# EAGLE design Line follwer (EAGLE 7.6.0)
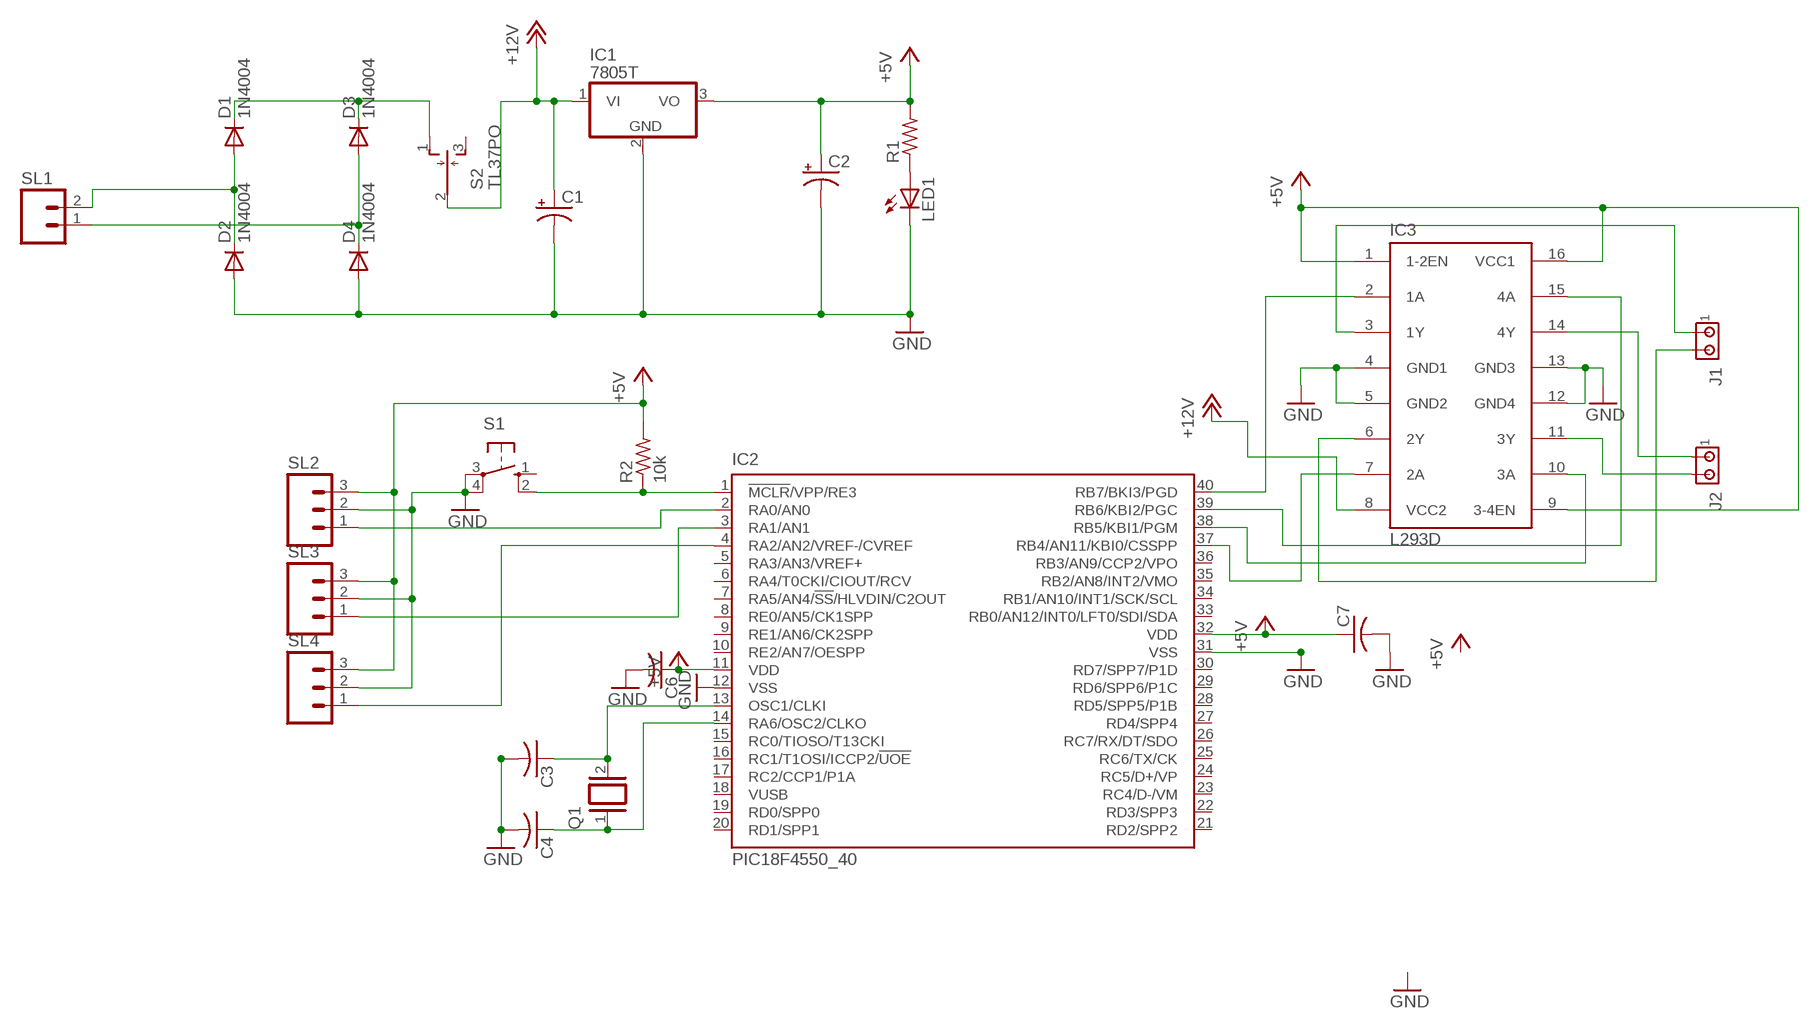
[diagram p0: schematic, sheet 1]

## Parts
C1  CPOL-USE3.5-8  [E3,5-8]
C2  CPOL-USE3.5-8  [E3,5-8]
C3  C-US025-024X044  [C025-024X044]
C4  C-US025-024X044  [C025-024X044]
C6  C-US025-024X044  [C025-024X044]
C7  C-US025-024X044  [C025-024X044]
D1  1N4004  [DO41-10]
D2  1N4004  [DO41-10]
D3  1N4004  [DO41-10]
D4  1N4004  [DO41-10]
IC1  7805T  [TO220H]
IC2  PIC18F4550_40  [DIL40]
IC3  L293D  [DIL16]
J1  MTA02-100  [10X02MTA]
J2  MTA02-100  [10X02MTA]
LED1  LED5MM  [LED5MM]
Q1  XTAL/S  [QS]
R1  R-US_0207/10  [0207/10]
R2  10k  R-US_0207/10  [0207/10]
S1  10-XX  [B3F-10XX]
S2  TL37PO  [TL3XPO]
SL1  MA02  [02PA]
SL2  MA03  [03P]
SL3  MA03  [03P]
SL4  MA03  [03P]

## Nets
+5V: C2.+ C6.1 C7.1 IC1.3(VO) IC2.11(VDD) IC2.32(VDD) IC3.1(1-2EN) IC3.9(3-4EN) IC3.16(VCC1) R1.2 R2.2 SL2.3 SL3.3 SL4.3
+12V: C1.+ IC1.1(VI) IC3.8(VCC2) S2.2(P)
GND: C1.- C2.- C3.2 C4.2 C6.2 C7.2 D2.A D4.A IC1.2(GND) IC2.12(VSS) IC2.31(VSS) IC3.4(GND1) IC3.5(GND2) IC3.12(GND4) IC3.13(GND3) LED1.K(C) S1.3(P) S1.4(P1) SL2.2 SL3.2 SL4.2
N$1: IC2.40(RB7/BKI3/PGD) IC3.2(1A)
N$2: D1.A D2.C SL1.2
N$3: D3.A D4.C SL1.1
N$4: IC2.37(RB4/AN11/KBI0/CSSPP) IC3.7(2A)
N$5: IC2.39(RB6/KBI2/PGC) IC3.15(4A)
N$6: LED1.A R1.1
N$7: IC2.38(RB5/KBI1/PGM) IC3.10(3A)
N$8: IC3.3(1Y) J1.1
N$9: IC3.6(2Y) J1.2
N$10: IC3.14(4Y) J2.1
N$11: IC2.1(!MCLR!/VPP/RE3) R2.1 S1.2(S1)
N$12: IC3.11(3Y) J2.2
N$13: IC2.2(RA0/AN0) SL2.1
N$14: IC2.3(RA1/AN1) SL3.1
N$15: IC2.4(RA2/AN2/VREF-/CVREF) SL4.1
N$24: C4.1 IC2.14(RA6/OSC2/CLKO) Q1.1
N$25: C3.1 IC2.13(OSC1/CLKI) Q1.2
N$114: D1.C D3.C S2.1(O)
Unconnected: IC2.5(RA3/AN3/VREF+) IC2.6(RA4/T0CKI/CIOUT/RCV) IC2.7(RA5/AN4/!SS!/HLVDIN/C2OUT) IC2.8(RE0/AN5/CK1SPP) IC2.9(RE1/AN6/CK2SPP) IC2.10(RE2/AN7/OESPP) IC2.15(RC0/TIOSO/T13CKI) IC2.16(RC1/T1OSI/ICCP2/!UOE) IC2.17(RC2/CCP1/P1A) IC2.18(VUSB) IC2.19(RD0/SPP0) IC2.20(RD1/SPP1) IC2.21(RD2/SPP2) IC2.22(RD3/SPP3) IC2.23(RC4/D-/VM) IC2.24(RC5/D+/VP) IC2.25(RC6/TX/CK) IC2.26(RC7/RX/DT/SDO) IC2.27(RD4/SPP4) IC2.28(RD5/SPP5/P1B) IC2.29(RD6/SPP6/P1C) IC2.30(RD7/SPP7/P1D) IC2.33(RB0/AN12/INT0/LFT0/SDI/SDA) IC2.34(RB1/AN10/INT1/SCK/SCL) IC2.35(RB2/AN8/INT2/VMO) IC2.36(RB3/AN9/CCP2/VPO) S1.1(S) S2.3(S)

## Library data of the parts
C1 C2 = adafruit:CPOL-US: POLARIZED CAPACITOR, American symbol
C3 C4 C6 C7 = adafruit:C-US: CAPACITOR, American symbol
D1-D4 = diode:1N4004: DIODE general purpose rectifier, 1 A
IC1 = adafruit:78*: Positive VOLTAGE REGULATOR Added bigger pads to the TO-92 package
IC2 = microchip:PIC18F4*_40: USB Microcontrollers with nanoWatt Technology High-Performance, Enhanced Flash, 28/40/44-Pin, Source: http://ww1.microchip.com/downloads/en/devicedoc/39632c.pdf; MF: MICROCHIP; MPN: PIC18F4550-I/P; OC_FARNELL: 9321357; OC_NEWARK: 74K8623
IC3 = st-microelectronics:L293D: PUSH-PULL 4 CHANNEL DRIVER; MPN: L293D; OC_FARNELL: 9589619; OC_NEWARK: 56P8249
J1 J2 = con-amp:MTA02-100: AMP connector
LED1 = adafruit:LED: LED OSRAM: - CHIPLED LG R971, LG N971, LY N971, LG Q971, LY Q971, LO R971, LY R971 LH N974, LH R974 LS Q976, LO Q976, LY Q976 LO Q996 - Hyper CHIPLED LW Q18S LB Q993, LB Q99A, LB R99A - SideLED LS A670, LO A670, LY A670, LG A670, LP A670 LB A673, LV A673, LT A673, LW A673 LH A674 LY A675 LS A676, LA A676, LO A676, LY A676, LW A676 LS A679, LY A679, LG A679 - Hyper Micro SIDELED® LS Y876, LA Y876, LO Y876, LY Y876 LT Y87S - SmartLED LW L88C, LW L88S LB L89C, LB L89S, LG L890 LS L89K, LO L89K, LY L89K LS L896, LA L896, LO L896, LY L896 - TOPLED LS T670, LO T670, LY T670, LG T670, LP T670 LSG T670, LSP T670, LSY T670, LOP T670, LYG T670 LG T671, LOG T671, LSG T671 LB T673, LV T673, LT T673, LW T673 LH T674 LS T676, LA T676, LO T676, LY T676, LB T676, LH T676, LSB T676, LW T676 LB T67C, LV T67C, LT T67C, LS T67K, LO T67K, LY T67K, LW E67C LS E67B, LA E67B, LO E67B, LY E67B, LB E67C, LV E67C, LT E67C LW T67C LS T679, LY T679, LG T679 LS T770, LO T770, LY T770, LG T770, LP T770 LB T773, LV T773, LT T773, LW T773 LH T774 LS E675, LA E675, LY E675, LS T675 LS T776, LA T776, LO T776, LY T776, LB T776 LHGB T686 LT T68C, LB T68C - Hyper Mini TOPLED® LB M676 - Mini TOPLED Santana® LG M470 LS M47K, LO M47K, LY M47K Source: http://www.osram.convergy.de/
Q1 = special:XTAL/S: CRYSTAL
R1 R2 = adafruit:R-US_: RESISTOR, American symbol
S1 = switch-omron:10-XX: OMRON SWITCH; MPN: B3F-1000; OC_FARNELL: 176432; OC_NEWARK: 36M3542
S2 = switch:TL37PO: TINY SWITCH MOM OFF MOM Source: http://www2.produktinfo.conrad.com/datenblaetter/700000-724999/705152-da-01-de-Subminiaturschalter_TL_36YO.pdf
SL1 = con-amp-quick:MA02: AMP QUICK CONNECTOR; OC_FARNELL: unknown; OC_NEWARK: unknown
SL2-SL4 = con-amp-quick:MA03: AMP QUICK CONNECTOR; OC_FARNELL: unknown; OC_NEWARK: unknown

## Board
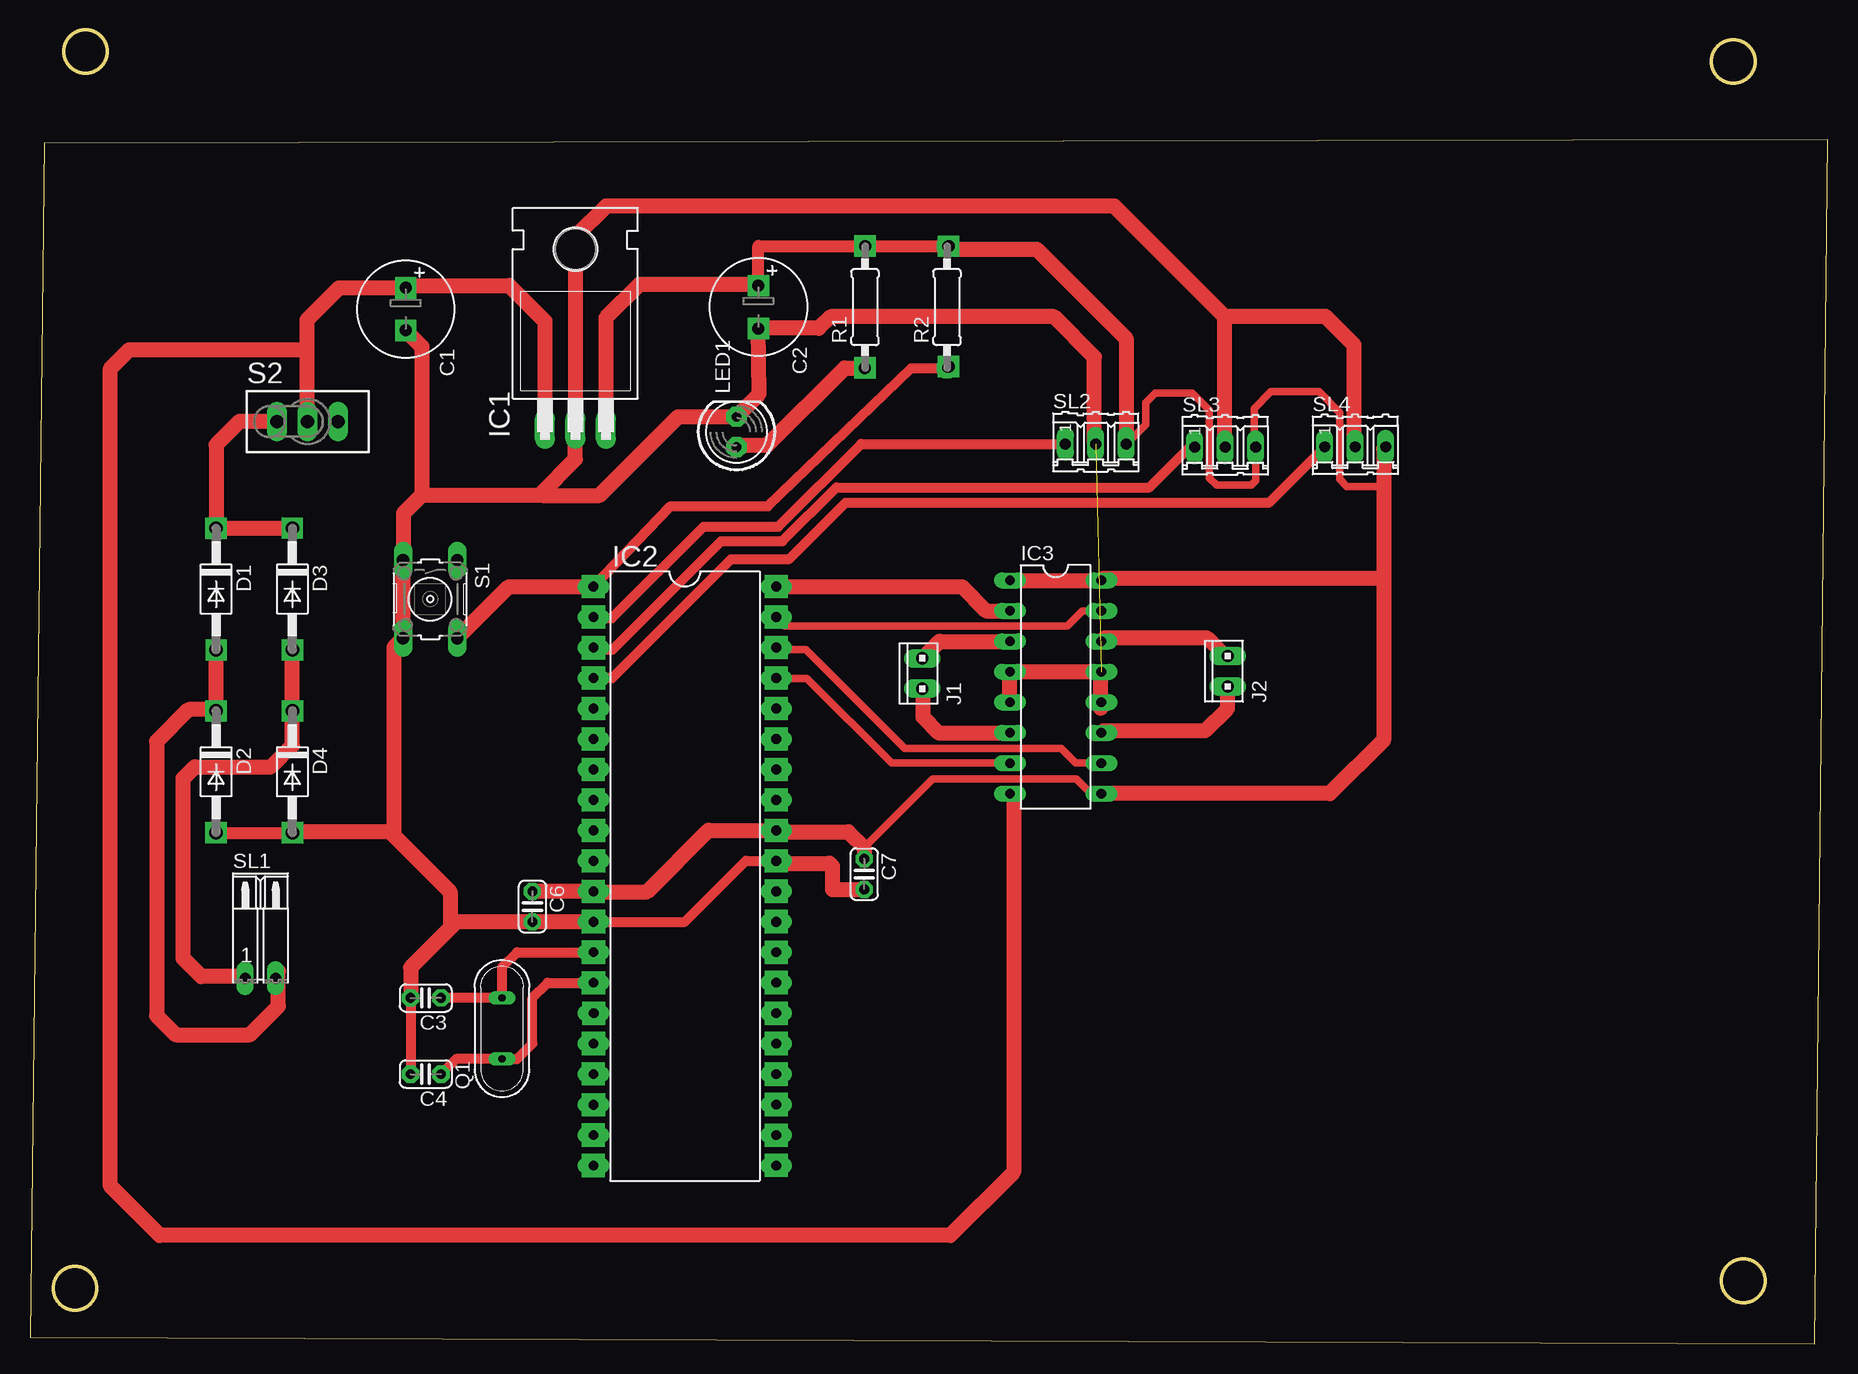
[diagram p1: board, top side]

Size 149.81 x 109.54 mm. Coordinates in mm from the lower left corner, seen from the top.
Outline: 0,0.55 148.73,0 149.81,100.41 1.19,100.1 0,0.55
Outline: circle at 4.63,107.74 radius 1.8
Outline: circle at 3.76,4.63 radius 1.8
Outline: circle at 142.76,5.27 radius 1.8
Outline: circle at 141.93,106.91 radius 1.8
Copper layers (1*16): Top 0.035mm / dielectric 1.5mm / Bottom 0.035mm
Design rules "default": minimum track width 10mil, minimum drill 24mil, track to track 8mil, track to pad 8mil, pad to pad 8mil, via to via 8mil, smd to smd 8mil, copper to edge 40mil, drill to drill 8mil, minimum pad ring 10mil, minimum via ring 8mil, stop-mask expansion 4mil, vias tented up to drill 0mil, thermal gap 10mil

### Footprints (pad centres in the part's own frame; a part is rotated, then mirrored left to right if it is on the bottom)
E3,5-8 = drill 0.813 pad 1.6: + -1.778,0 | drill 0.813 pad 1.6 octagon: - 1.778,0
C025-024X044 = drill 0.813 pad 1.422 octagon: 1 -1.27,0; 2 1.27,0
DO41-10 = drill 1.118: A 5.08,0; C -5.08,0
TO220H = drill 1.118 long: 1 -2.54,-10.16; 2 0,-10.16; 3 2.54,-10.16 | hole 3.302: 0,4.826
DIL40 = drill 0.813 long: 1 -24.13,-7.62; 2 -21.59,-7.62; 3 -19.05,-7.62; 4 -16.51,-7.62; 5 -13.97,-7.62; 6 -11.43,-7.62; 7 -8.89,-7.62; 8 -6.35,-7.62; 9 -3.81,-7.62; 10 -1.27,-7.62; 11 1.27,-7.62; 12 3.81,-7.62; 13 6.35,-7.62; 14 8.89,-7.62; 15 11.43,-7.62; 16 13.97,-7.62; 17 16.51,-7.62; 18 19.05,-7.62; 19 21.59,-7.62; 20 24.13,-7.62; 21 24.13,7.62; 22 21.59,7.62; 23 19.05,7.62; 24 16.51,7.62; 25 13.97,7.62; 26 11.43,7.62; 27 8.89,7.62; 28 6.35,7.62; 29 3.81,7.62; 30 1.27,7.62; 31 -1.27,7.62; 32 -3.81,7.62; 33 -6.35,7.62; 34 -8.89,7.62; 35 -11.43,7.62; 36 -13.97,7.62; 37 -16.51,7.62; 38 -19.05,7.62; 39 -21.59,7.62; 40 -24.13,7.62
DIL16 = drill 0.813 long: 1 -8.89,-3.81; 2 -6.35,-3.81; 3 -3.81,-3.81; 4 -1.27,-3.81; 5 1.27,-3.81; 6 3.81,-3.81; 7 6.35,-3.81; 8 8.89,-3.81; 9 8.89,3.81; 10 6.35,3.81; 11 3.81,3.81; 12 1.27,3.81; 13 -1.27,3.81; 14 -3.81,3.81; 15 -6.35,3.81; 16 -8.89,3.81
10X02MTA = drill 1.016 long: 1 1.27,0; 2 -1.27,0
LED5MM = drill 0.813 pad 1.676 octagon: A -1.27,0; K 1.27,0
QS = drill 0.61 long: 1 -2.54,0; 2 2.54,0
0207/10 = drill 0.813 pad 1.676 octagon: 1 -5.08,0; 2 5.08,0
B3F-10XX = drill 1.016 long: 1 -3.251,2.261; 2 3.251,2.261; 3 -3.251,-2.261; 4 3.251,-2.261
TL3XPO = drill 1.1 pad 1.422 long: 1 -2.54,0; 2 0,0; 3 2.54,0
02PA = drill 0.914 long: 1 -1.27,0; 2 1.27,0
03P = drill 0.914 long: 1 -2.54,0; 2 0,0; 3 2.54,0

### Placement (x,y rotation side)
C1  31.31,86.26 270 top
C2  60.7,86.44 270 top
C3  32.98,28.84 180 top
C4  32.98,22.49 180 top
C6  41.87,36.46 270 top
C7  69.52,39.16 270 top
D1  15.51,62.93 270 top
D2  15.51,47.69 270 top
D3  21.86,62.93 270 top
D4  21.86,47.69 270 top
IC1  45.46,86.44 0 top
IC2  54.57,39 270 top
IC3  85.47,54.76 270 top
J1  74.36,55.89 90 top
J2  99.8,56.09 90 top
LED1  58.88,76.02 90 top
Q1  39.33,26.3 90 top
R1  69.59,86.44 90 top
R2  76.42,86.44 90 top
S1  33.35,62.08 270 top
S2  23.13,76.89 0 top
SL1  19.2,30.48 0 top
SL2  88.81,75.03 0 top
SL3  99.59,74.75 0 top
SL4  110.43,74.79 0 top

### Tracks (layer width: path | path; a pad name or v marks a point on that pad's centre or on a via)
+5V
  Top 0.61: 69.52,41.38 75.24,47.1 87.17,47.1 88.4,45.87 IC3.9 | SL2.3 92.96,76.64 92.96,78.46 93.77,79.27 96.87,79.27 98.29,77.86 98.29,72.2 98.89,71.59 101.76,71.59 102.13,71.96 SL3.3 102.03,74.85 102.03,77.99 103.41,79.37 107.42,79.37 109.14,77.65 109.14,72.09 109.74,71.49 112.8,71.49
  Top 1.016: C2.+ 60.7,91.52 R1.2 R2.2
  Top 1.27: C6.1 IC2.11 46.98,37.7 51.42,37.7 56.53,42.81 IC2.32 62.31,42.69 68.2,42.69 69.52,41.38 C7.1 | C2.+ 60.6,88.31 50.77,88.31 48,85.54 IC1.3 | R2.2 76.69,91.25 83.91,91.25 91.35,83.81 SL2.3 | SL4.3 112.8,74.61 112.8,71.49 112.8,63.84 | 112.8,63.84 112.8,50.34 108.33,45.87 IC3.9 | IC3.1 IC3.16 89.47,63.84 112.8,63.84
+12V
  Top 1.27: S2.2 23.09,76.93 23.09,82.88 | 23.09,82.88 23.09,85.38 25.76,88.04 C1.+ 31.5,88.23 39.95,88.23 42.92,85.27 IC1.1 | IC3.8 81.97,45.56 81.97,14.32 76.7,9.05 10.81,9.05 6.69,13.17 6.69,81.31 8.26,82.88 23.09,82.88
GND  (1 unrouted)
  Top 0.813: IC2.12 54.57,35.19 59.65,40.27 IC2.31 | C3.2 C4.2
  Top 1.016: D2.A D4.A
  Top 1.27: 35.01,34.68 35.52,35.19 C6.2 IC2.12 | 35.01,34.68 31.71,31.38 C3.2 | D4.A 21.98,42.73 29.97,42.73 30.32,42.39 | 30.32,42.39 35.01,37.69 35.01,34.68 | 30.32,42.39 30.32,58.06 S1.4 S1.3 31.15,65.39 31.15,69.26 32.66,70.77 | 32.66,70.77 42.47,70.77 42.56,70.86 | 42.56,70.86 45.46,73.76 IC1.2 45.46,92.31 48.01,94.86 90.37,94.86 99.58,85.66 | C1.- 32.66,83.14 32.66,70.77 | SL2.2 88.7,75.14 88.7,82.27 85.34,85.63 66.72,85.63 65.75,84.66 C2.- 60.75,79.19 LED1.K 54,77.29 47.45,70.74 42.68,70.74 42.56,70.86 | SL3.2 99.58,74.76 99.58,85.66 | SL4.2 110.34,74.88 110.34,83.28 107.96,85.66 99.58,85.66 | IC3.12 89.28,53.06 89.2,52.99 89.2,55.95 IC3.13 IC3.4 IC3.5 | IC2.31 62.39,40.07 66.63,40.07 66.87,39.82 66.87,37.88 66.88,37.89 C7.2
N$1
  Top 1.27: IC2.40 62.2,63.12 77.65,63.12 79.66,61.11 IC3.2
N$2
  Top 1.27: D1.A D2.C 15.4,52.88 13.2,52.88 10.56,50.23 10.56,27.36 12.15,25.77 18.32,25.77 20.71,28.16 20.71,31.07 20.47,30.84 SL1.2
N$3
  Top 1.27: D3.A D4.C 21.86,49.88 20.09,48.11 13.73,48.11 12.76,47.14 12.76,32.13 14.26,30.63 17.78,30.63 SL1.1
N$4
  Top 0.61: IC2.37 62.23,55.47 64.74,55.47 71.8,48.41 IC3.7
N$5
  Top 0.61: IC2.39 62.92,59.86 86.43,59.86 87.68,61.11 IC3.15
N$6
  Top 1.27: LED1.A 59.04,74.91 61.44,74.91 67.88,81.36 R1.1
N$7
  Top 0.61: IC2.38 62.36,57.88 64.64,57.88 72.88,49.64 85.93,49.64 87.16,48.41 IC3.10
N$8
  Top 1.27: J1.1 75.77,58.57 IC3.3
N$9
  Top 1.27: J1.2 74.4,54.58 74.4,52.25 75.7,50.95 IC3.6
N$10
  Top 1.27: IC3.14 89.58,58.87 98.05,58.87 99.57,57.36 J2.1
N$11
  Top 0.813: IC2.1 53.36,69.83 61.5,69.83 73.42,81.33 R2.1
  Top 1.27: S1.2 39.91,63.13 IC2.1
N$12
  Top 1.27: IC3.11 89.45,51.12 97.94,51.12 99.8,52.99 J2.2
N$13
  Top 0.813: IC2.2 47.04,60.5 48.5,60.5 56.13,68.14 62.36,68.14 69.25,75.03 SL2.1
N$14
  Top 0.813: IC2.3 47.12,57.88 48.56,57.88 57.59,66.91 62.71,66.91 67.19,71.4 93.28,71.4 96.63,74.75 SL3.1
N$15
  Top 0.813: SL4.1 103.22,70.12 67.95,70.12 63.23,65.4 58.4,65.4 48.51,55.51 IC2.4
N$24
  Top 0.813: C4.1 35.52,23.76 Q1.1 40.6,23.76 41.87,25.03 41.87,28.84 43.14,30.11 IC2.14
N$25
  Top 0.813: C3.1 Q1.2 39.33,31.38 40.6,32.65 IC2.13
N$52  (via drill 1 pad 1.78)
  other vias: 76.54,91.51
N$53  (via drill 1 pad 1.78)
  other vias: 76.54,81.48
N$54  (via drill 1 pad 1.78)
  other vias: 69.59,91.52
N$55  (via drill 1 pad 1.78)
  other vias: 69.58,81.36
N$56  (via drill 1 pad 1.78)
  other vias: 60.7,88.22
N$57  (via drill 1 pad 1.78)
  other vias: 60.71,84.66
N$58  (via drill 1 pad 1.78)
  other vias: 31.31,88.04
N$59  (via drill 1 pad 1.78)
  other vias: 31.32,84.5
N$60  (via drill 1 pad 1.78)
  other vias: 21.86,68.01
N$61  (via drill 1 pad 1.78)
  other vias: 21.86,57.85
N$62  (via drill 1 pad 1.78)
  other vias: 21.87,52.76
N$63  (via drill 1 pad 1.78)
  other vias: 21.86,42.61
N$64  (via drill 1 pad 1.78)
  other vias: 15.5,42.61
N$65  (via drill 1 pad 1.78)
  other vias: 15.51,57.85
N$66  (via drill 1 pad 1.78)
  other vias: 15.5,68.01
N$67  (via drill 1 pad 1.78)
  other vias: 15.51,52.76
N$68  (via drill 0.8 pad 1.93)
  other vias: 46.94,63.13
N$69  (via drill 0.8 pad 1.93)
  other vias: 46.95,60.61
N$70  (via drill 0.8 pad 1.93)
  other vias: 46.95,58.04
N$71  (via drill 0.8 pad 1.93)
  other vias: 46.96,55.5
N$72  (via drill 0.8 pad 1.93)
  other vias: 46.96,52.98
N$73  (via drill 0.8 pad 1.93)
  other vias: 46.94,50.43
N$74  (via drill 0.8 pad 1.93)
  other vias: 46.95,47.88
N$75  (via drill 0.8 pad 1.93)
  other vias: 46.95,45.34
N$76  (via drill 0.8 pad 1.93)
  other vias: 46.95,42.81
N$77  (via drill 0.8 pad 1.93)
  other vias: 46.95,40.27
N$78  (via drill 0.8 pad 1.93)
  other vias: 46.95,37.73
N$79  (via drill 0.8 pad 1.93)
  other vias: 46.96,35.2
N$80  (via drill 0.8 pad 1.93)
  other vias: 46.95,32.66
N$81  (via drill 0.8 pad 1.93)
  other vias: 46.96,30.11
N$82  (via drill 0.8 pad 1.93)
  other vias: 46.98,27.57
N$83  (via drill 0.8 pad 1.93)
  other vias: 46.96,25.04
N$84  (via drill 0.8 pad 1.93)
  other vias: 46.95,22.5
N$85  (via drill 0.8 pad 1.93)
  other vias: 46.96,19.93
N$86  (via drill 0.8 pad 1.93)
  other vias: 46.95,17.41
N$87  (via drill 0.8 pad 1.93)
  other vias: 46.95,14.87
N$90  (via drill 0.8 pad 1.93)
  other vias: 62.19,14.88
N$91  (via drill 0.8 pad 1.93)
  other vias: 62.19,17.4
N$92  (via drill 0.8 pad 1.93)
  other vias: 62.18,19.95
N$93  (via drill 0.8 pad 1.93)
  other vias: 62.19,22.49
N$94  (via drill 0.8 pad 1.93)
  other vias: 62.19,25.03
N$95  (via drill 0.8 pad 1.93)
  other vias: 62.18,27.57
N$96  (via drill 0.8 pad 1.93)
  other vias: 62.19,30.12
N$97  (via drill 0.8 pad 1.93)
  other vias: 62.18,32.65
N$98  (via drill 0.8 pad 1.93)
  other vias: 62.18,35.2
N$99  (via drill 0.8 pad 1.93)
  other vias: 62.18,37.74
N$100  (via drill 0.8 pad 1.93)
  other vias: 62.19,40.27
N$101  (via drill 0.8 pad 1.93)
  other vias: 62.19,42.82
N$102  (via drill 0.8 pad 1.93)
  other vias: 62.18,45.36
N$103  (via drill 0.8 pad 1.93)
  other vias: 62.18,47.9
N$104  (via drill 0.8 pad 1.93)
  other vias: 62.19,50.44
N$105  (via drill 0.8 pad 1.93)
  other vias: 62.19,52.97
N$106  (via drill 0.8 pad 1.93)
  other vias: 62.18,55.51
N$107  (via drill 0.8 pad 1.93)
  other vias: 62.19,58.05
N$108  (via drill 0.8 pad 1.93)
  other vias: 62.19,60.59
N$109  (via drill 0.8 pad 1.93)
  other vias: 62.18,63.13
N$114
  Top 1.27: D3.C D1.C 15.51,74.96 17.44,76.9 20.58,76.9 S2.1